# EAGLE design BRD161206 (EAGLE 7.6.0)
BOARD: GNSS click; REV: R00.0X; TITLE: GNSS click
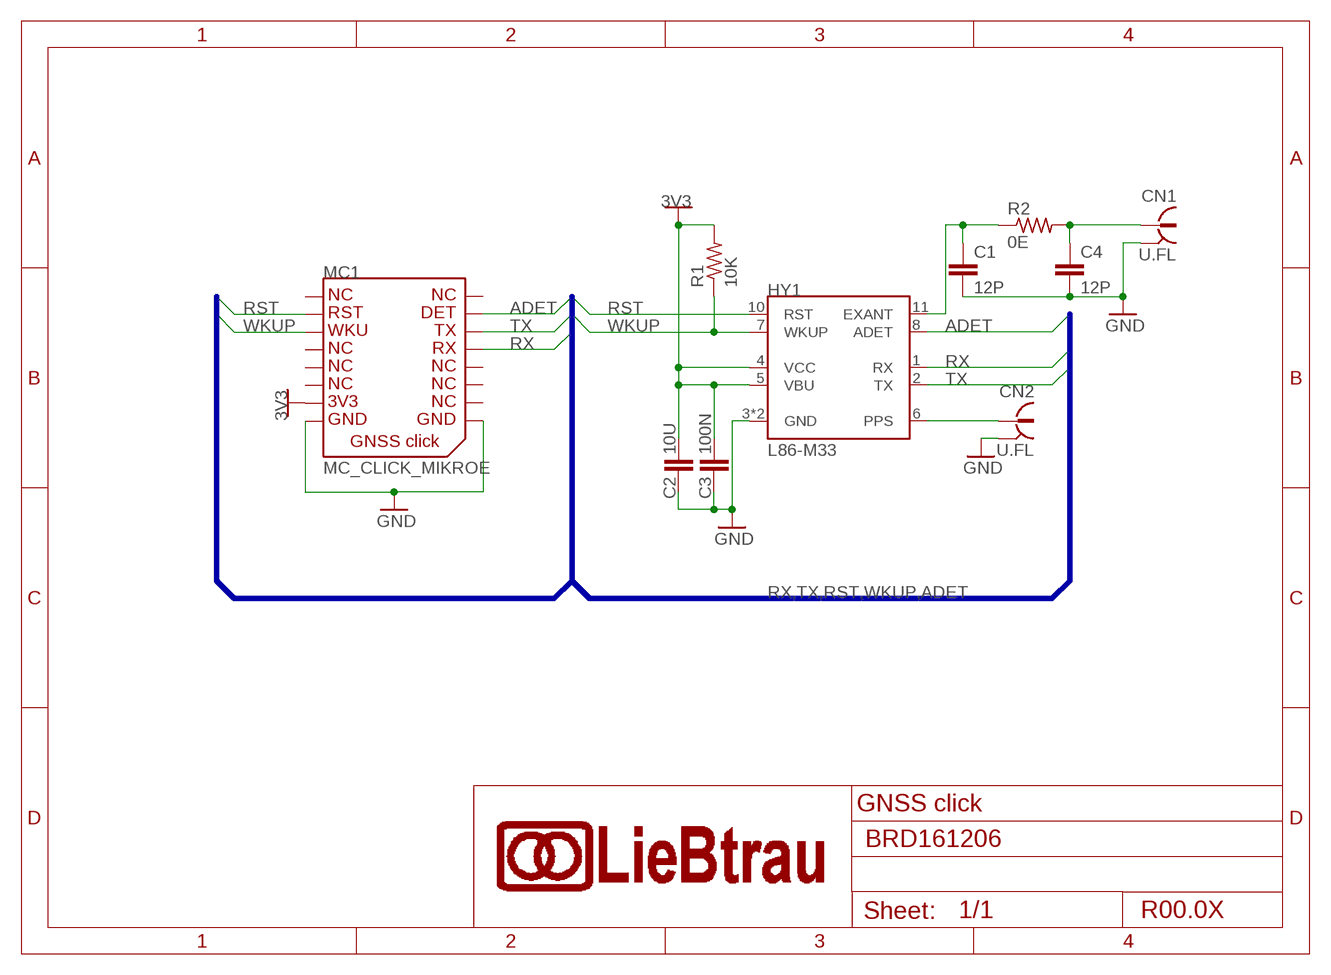
[diagram p0: schematic, sheet 1]

## Parts
C1  12P  CA_12P_0603  [CA_0603]
C2  10U  CA_10U_1206  [CA_1206]
C3  100N  CA_100N_1206  [CA_1206]
C4  12P  CA_12P_0603  [CA_0603]
CN1  U.FL  CN_COAX_UMC_IPEX_U.FL_MALE  [CN_RF_U.FL_MALE]
CN2  U.FL  CN_COAX_UMC_IPEX_U.FL_MALE  [CN_RF_U.FL_MALE]
HY1  L86-M33  HY_GNSS_QUECTEL_L86-M33  [HY_GNSS_L86-M33]
MC1  MC_CLICK_MIKROE  [MC_CLICK_MIKROE]
R1  10K  RE_10K_1206  [RE_1206]
R2  0E  RE_0E_0603  [RE_0603]

## Nets
3V3: C2.1 C3.1 HY1.4(VCC) HY1.5(VBU) MC1.P$7 R1.2
ADET: HY1.8(ADET) MC1.P$15
GND: C1.2 C2.2 C3.2 C4.2 CN1.2A(OUTER) CN1.2B(OUTER) CN2.2A(OUTER) CN2.2B(OUTER) HY1.3(GND) HY1.12(GND) MC1.P$8 MC1.P$9
N$1: C1.1 HY1.11(EXANT) R2.1
N$2: CN2.1(INNER) HY1.6(PPS)
N$3: C4.1 CN1.1(INNER) R2.2
RST: HY1.10(RST) MC1.P$2
RX: HY1.1(RX) MC1.P$13
TX: HY1.2(TX) MC1.P$14
WKUP: HY1.7(WKUP) MC1.P$3 R1.1
Unconnected: MC1.P$1 MC1.P$4 MC1.P$5 MC1.P$6 MC1.P$10 MC1.P$11 MC1.P$12 MC1.P$16

## Buses
RX,TX,RST,WKUP,ADET

## Library data of the parts
C1 C4 = lieBtrau:CA; COST: 0.09; ORDERCODE: 1276-1254-1-ND
C2 = lieBtrau:CA; COST: 0.27; ORDERCODE: 1276-6767-1-ND
C3 = lieBtrau:CA; COST: 0.09; ORDERCODE: 399-1249-1-ND
CN1 CN2 = lieBtrau:CN_COAX; COST: 0.69; ORDERCODE: WM5587CT-ND
HY1 = lieBtrau:HY_GNSS_QUECTEL_L86-M33; COST: 14.08; ORDERCODE: RS: 908-4114
MC1 = lieBtrau:MC_CLICK_MIKROE: Mikroelektronika Click board <http://www.mikroe.com/click/>; 3V3: 3V3; 5V: NC; AN: NC; CS: WKU; INT: DET; MISO: NC; MOSI: NC; PWM: NC; RST: RST; RX: RX; SCK: NC; SCL: NC; SDA: NC; TX: TX
R1 = lieBtrau:RE: Yageo RC1206 Stackpole RMCF1206; COST: 0.09; ORDERCODE: 311-10.0KFRCT-ND
R2 = lieBtrau:RE: Yageo RC1206 Stackpole RMCF1206; COST: 0.09; ORDERCODE: 311-0.0GRCT-ND

## Board
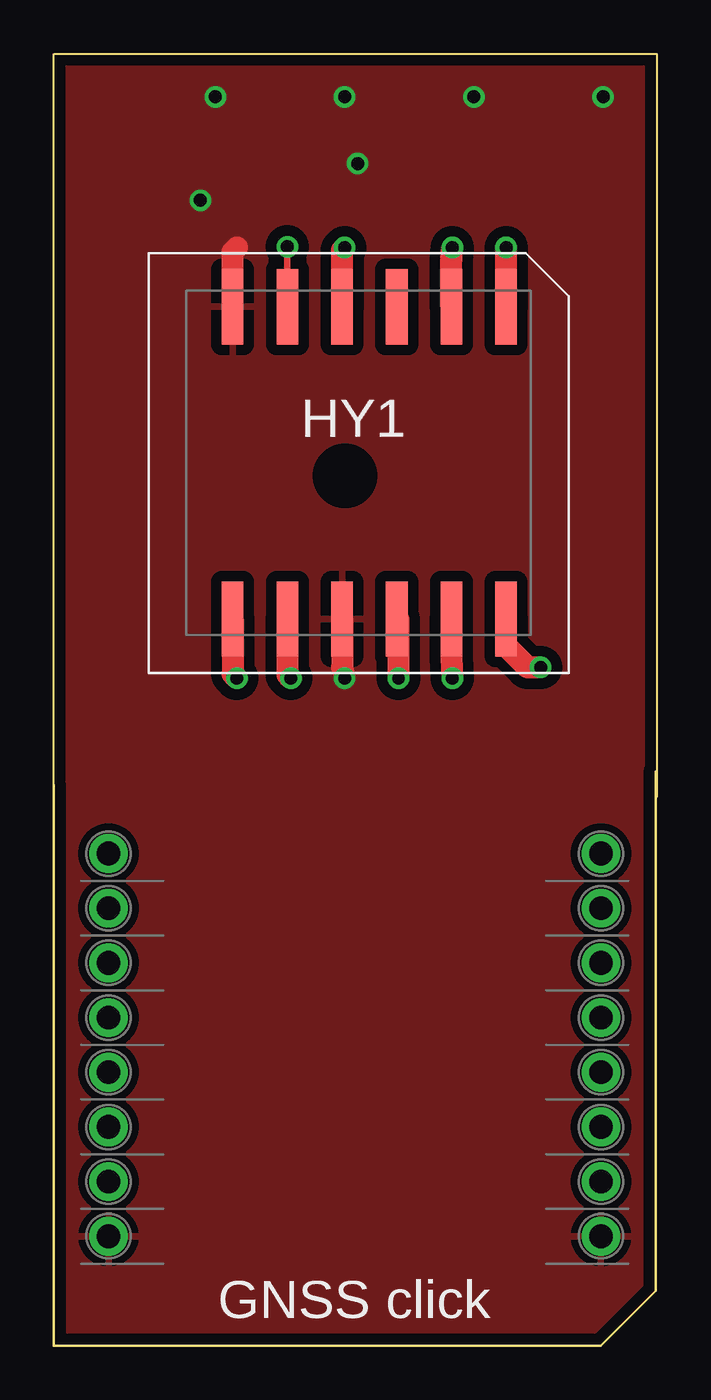
[diagram p1: board, top side]
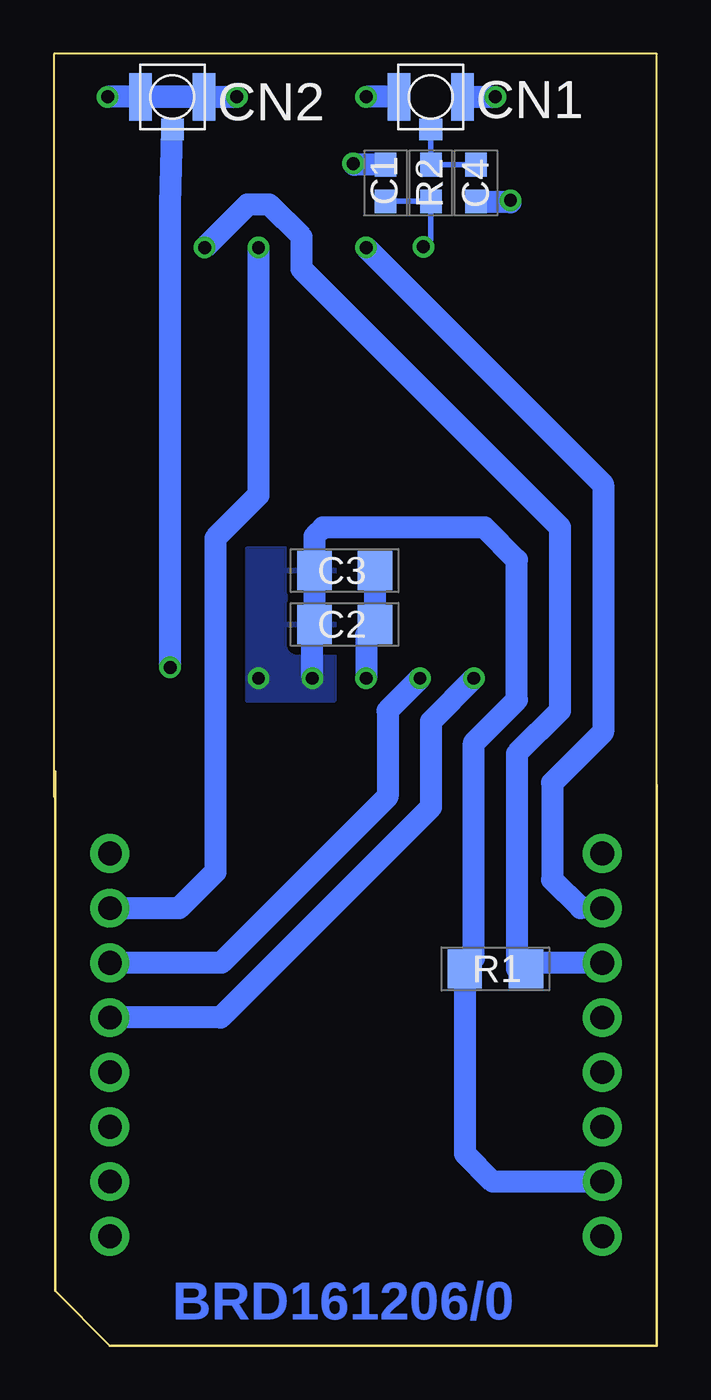
[diagram p2: board, bottom side, seen from below]

Size 28 x 60 mm. Coordinates in mm from the lower left corner, seen from the top.
Outline: 0,25.5 0,60 28,60 28,25.5
Copper layers (1*16): Top 0.035mm / dielectric 1.5mm / Bottom 0.035mm
Design rules "dtron *": minimum track width 0.175mm, minimum drill 0.6mm, track to track 0.5mm, track to pad 0.5mm, pad to pad 0.2mm, via to via 0.25mm, smd to smd 0.2mm, copper to edge 0.5mm, drill to drill 0.2mm, minimum pad ring 0.25mm, minimum via ring 0.2mm, stop-mask expansion 0.1mm, vias tented up to drill 0mil, thermal gap 0.5mm

### Footprints (pad centres in the part's own frame; a part is rotated, then mirrored left to right if it is on the bottom)
CA_0603 = smd 1.1 x 1: 1 -0.85,0; 2 0.85,0
CA_1206 = smd 1.6 x 1.8: 1 -1.4,0; 2 1.4,0
CN_RF_U.FL_MALE = smd 1.05 x 1: 1 0,-1.52 | smd 1.05 x 2.2: 2A -1.47,0; 2B 1.47,0
HY_GNSS_L86-M33 = smd 3.5 x 1: 1 7.25,-6.7; 2 7.25,-4.16; 3 7.25,-1.62; 4 7.25,0.92; 5 7.25,3.46; 6 7.25,6; 7 -7.25,6; 8 -7.25,3.46; 9 -7.25,0.92; 10 -7.25,-1.62; 11 -7.25,-4.16; 12 -7.25,-6.7
MC_CLICK_MIKROE = drill 1.1 pad 1.8: P$1 -11.43,17.78; P$2 -11.43,15.24; P$3 -11.43,12.7; P$4 -11.43,10.16; P$5 -11.43,7.62; P$6 -11.43,5.08; P$7 -11.43,2.54; P$8 -11.43,0; P$9 11.43,0; P$10 11.43,2.54; P$11 11.43,5.08; P$12 11.43,7.62; P$13 11.43,10.16; P$14 11.43,12.7; P$15 11.43,15.24; P$16 11.43,17.78
RE_1206 = smd 1.6 x 1.803: 1 -1.422,0; 2 1.422,0
RE_0603 = smd 1.1 x 1: 1 -0.85,0; 2 0.85,0

### Placement (x,y rotation side)
C1  12.6,54 90 bottom
C2  14.5,33.5 0 bottom
C3  14.5,36 0 bottom
C4  8.4,54 270 bottom
CN1  10.5,58 0 bottom
CN2  22.5,58 0 bottom
HY1  15,41 270 top
MC1  13.97,5.08 0 top
R1  7.5,17.5 180 bottom
R2  10.5,54 90 bottom
U$2  [MC_FRAME_A5]  -36,-52.5 0 top  (outside the outline)

### Tracks (layer width: path | path; a pad name or v marks a point on that pad's centre or on a via)
3V3  (via drill 0.6)
  Top 1.016: HY1.4 arc-90 16,33.67 v16,31 | HY1.5 18.46,31.96 v18.5,31
  Bottom 1.016: v16,31 16,32.9 C2.1 C3.1 15.9,37.6 15.5,38 8,38 6.5,36.5 6.5,30 8.5,28 8.5,18 R1.2 8.92,8.92 7.62,7.62 MC1.P$7
  pour Bottom: 15,37 19,37 19,30 15,30
ADET  (via drill 0.6)
  Top 1.016: HY1.8 18.46,50.46 v18.5,51
  Bottom 1.016: v18.5,51 18.5,39.5 20.5,37.5 20.5,22 22.18,20.32 MC1.P$15
GND  (via drill 0.6)
  Top 1.016: HY1.3 13.38,31.5 v13.5,31 | HY1.12 8.3,50.8 8.5,51
  Bottom 0.254: C4.2 8.4,53.2 v6.8,53.2
  Bottom 1.016: C3.2 C2.2 13.5,33 v13.5,31 | CN1.2B v7.5,58 | CN1.2A v13.5,58 | CN2.2A v19.5,58 | CN2.2B v25.5,58 | C1.2 14.05,54.85 v14.1,54.9 | v6.8,53.2 6.8,53.1 8.4,53.1
  pour Top: 0,60 28,60 28,2.5 25.5,0 0,0
N$1  (via drill 0.6)
  Top 0.305: v10.84,51.04 HY1.11
  Bottom 0.254: C1.1 R2.1 10.5,51.38 v10.84,51.04
N$2  (via drill 0.6)
  Top 1.016: v22.6,31.5 22,31.5 21,32.5 HY1.6
  Bottom 1.016: v22.6,31.5 22.6,53 CN2.1
N$3
  Bottom 0.254: CN1.1 R2.2 C4.1
RST  (via drill 0.6)
  Top 1.016: HY1.10 13.38,50.88 v13.5,51
  Bottom 1.016: v13.5,51 2.5,40 2.5,28.5 4.86,26.14 4.86,21.64 3.54,20.32 MC1.P$2
RX  (via drill 0.6)
  Top 1.016: HY1.1 8.3,31.2 v8.5,31
  Bottom 1.016: v8.5,31 10.5,29 10.5,25 20.26,15.24 MC1.P$13
TX  (via drill 0.6)
  Top 1.016: HY1.2 10.84,31.16 v11,31
  Bottom 1.016: v11,31 12.5,29.5 12.5,25.5 20.22,17.78 MC1.P$14
WKUP  (via drill 0.6)
  Top 1.016: HY1.7 v21,51
  Bottom 1.016: MC1.P$3 5.8,17.78 R1.1 | 6,17.58 R1.1 | v21,51 19,53 18,53 16.5,51.5 16.5,50 4.5,38 4.5,29.5 6.5,27.5 6.5,17.5 R1.1

### Text on the board
Bottom: BRD161206/0